# Altium schematic sheet bms-slave-magnetics.SchDoc: foxBMS BMS-Interface
size A3; DocumentNumber: 4; SheetNumber: 4; SheetTotal: 6; Author: Fraunhofer IISB foxBMS Team; REL-DATE: 2017-05-09; VERSION: 1.1.0; GateName_1: G$1; SymbolName_1: FRAME_B_L; LibraryName: foxBMS_BMS-Master_V1.00_A; DeviceSetName: FRAME_B_L; GateName_2: G$2; SymbolName_2: DOCFIELD; SheetDescription: Daisy Chain Isolation
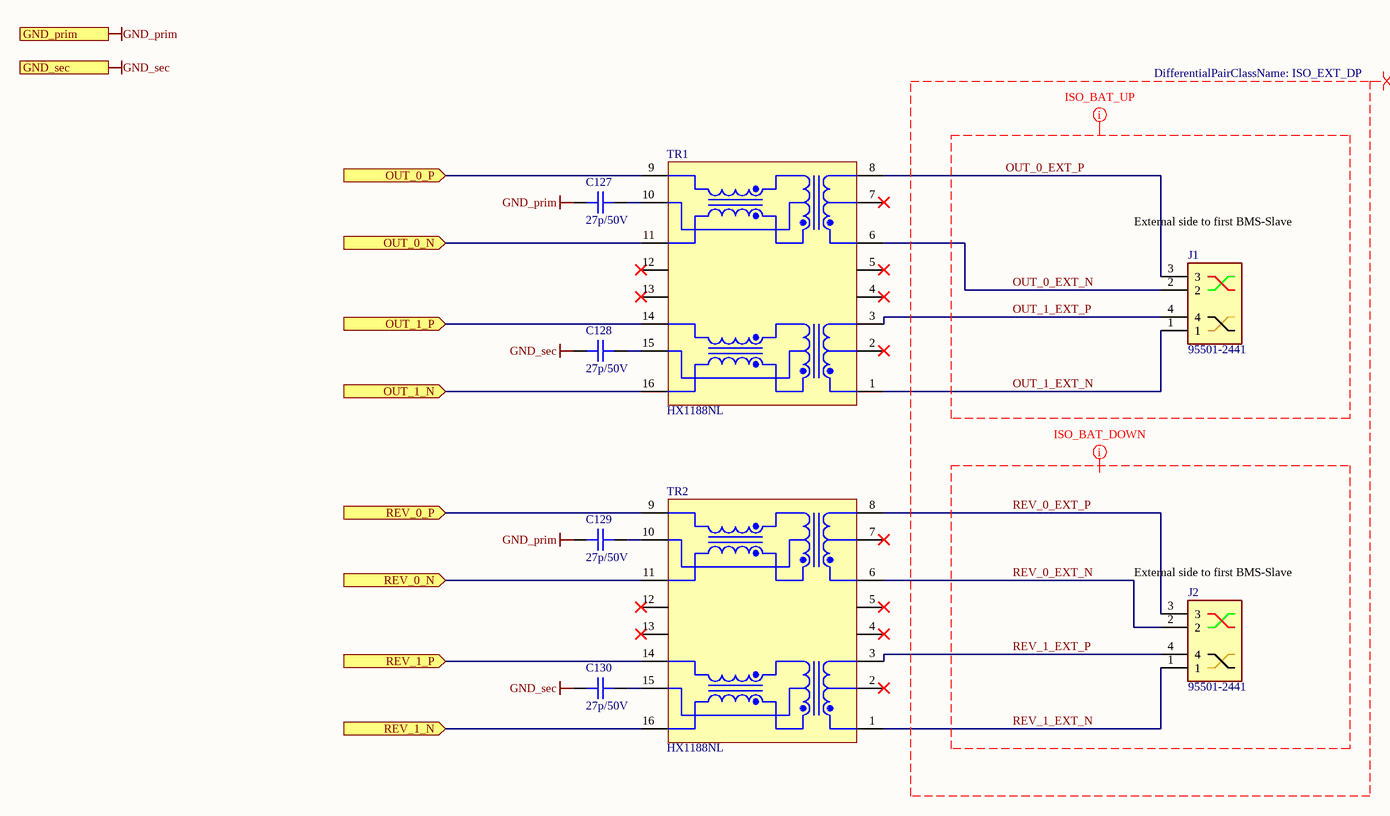
[diagram p0: bms-slave-magnetics.SchDoc]

## Parts
C127  27p/50V  [0603C]
C128  27p/50V  [0603C]
C129  27p/50V  [0603C]
C130  27p/50V  [0603C]
J1  95501-2441  [95501-2441]
J2  95501-2441  [95501-2441]
TR1  HX1188NL  [PULS-MODULE-16_V]
TR2  HX1188NL  [PULS-MODULE-16_V]

## Ports
GND_prim, GND_sec, OUT_0_N (in), OUT_0_P (in), OUT_1_N (in), OUT_1_P (in), REV_0_N (in), REV_0_P (in), REV_1_N (in), REV_1_P (in)

## Nets
GND_prim: C127.2 C129.2 ; port GND_prim
GND_sec: C128.1 C130.1 ; port GND_sec
OUT_0_EXT_N: J1.2 TR1.6
OUT_0_EXT_P: J1.3 TR1.8
OUT_0_N: TR1.11 ; port OUT_0_N
OUT_0_P: TR1.9 ; port OUT_0_P
OUT_1_EXT_N: J1.1 TR1.1
OUT_1_EXT_P: J1.4 TR1.3
OUT_1_N: TR1.16 ; port OUT_1_N
OUT_1_P: TR1.14 ; port OUT_1_P
REV_0_EXT_N: J2.2 TR2.6
REV_0_EXT_P: J2.3 TR2.8
REV_0_N: TR2.11 ; port REV_0_N
REV_0_P: TR2.9 ; port REV_0_P
REV_1_EXT_N: J2.1 TR2.1
REV_1_EXT_P: J2.4 TR2.3
REV_1_N: TR2.16 ; port REV_1_N
REV_1_P: TR2.14 ; port REV_1_P
NetC127_1: C127.1 TR1.10
NetC128_2: C128.2 TR1.15
NetC129_1: C129.1 TR2.10
NetC130_2: C130.2 TR2.15

Not connected (* = marked no-connect by the designer): TR1 2* 4* 5* 7* 12* 13*; TR2 2* 4* 5* 7* 12* 13*

## Layout directives
net class ISO_BAT; net class ISO_BAT_UP: OUT_0_EXT_N, OUT_0_EXT_P, OUT_1_EXT_N, OUT_1_EXT_P
net class ISO_BAT; net class ISO_BAT_DOWN: REV_0_EXT_N, REV_0_EXT_P, REV_1_EXT_N, REV_1_EXT_P
differential pair; differential pair class ISO_EXT_DP; rule Differential Pairs Routing [Pref Gap = 25.59mil    Min Gap  = 5mil    Max Gap  = 78.74milPref Width = 6mil    Min Width  = 0.955mil    Max Width  = 10.997mil]: OUT_0_EXT_N, OUT_0_EXT_P, OUT_1_EXT_N, OUT_1_EXT_P, REV_0_EXT_N, REV_0_EXT_P, REV_1_EXT_N, REV_1_EXT_P

## Notes on the sheet
- (near J1) External side to first BMS-Slave
- (near J2) External side to first BMS-Slave
- Fraunhofer IISB
- Schottkystr. 10
- developed by:
- 91058 Erlangen
- Germany
- Author
- Project
- License
- Description
- File
- Version
- Release Date
- Sheet
- www.foxbms.org
- www.iisb.fraunhofer.de
- foxBMS Team
- /

## Library data of the parts
C127-C130 = gen_C_ceramic_27p_50V_NP0_0603: MLCC; Capacitance: 27p; Rated Voltage: 50V; Dielectric: NP0; Case EIA: 0603; Case Metric: 1608; PnP Package: C_0603_05; Automotive Qualified: True; Part Number: gen_C_ceramic_27p_50V_NP0_0603; Supplier 1: Farnell; Supplier Part Number 1: 2219430; PnP Value: *
J1 J2 = 95501-2441: Connector; Manufacturer_Name: Molex; Allied_Number: 70372436; Datasheet Link: http://www.molex.com/webdocs/datasheets/pdf/en-us/0955012441_MODULAR_JACKS_PLUG.pdf; Manufacturer_Part_Number: 95501-2441; Mouser Part Number: 538-95501-2441; Mouser Price/Stock: https://www.mouser.com/Search/Refine.aspx?Keyword=538-95501-2441; RS Part Number: 2400913; RS Price/Stock: https://uk.rs-online.com/web/p/products/2400913; Allied Price/Stock: http://www.alliedelec.com/molex-incorporated-95501-2441/70372436/
TR1 TR2 = CMP-2000-05323-1: 10/100 Base-T Single Port Surface Mount Magnetic with Turns Ratio, -40 to 85 degC, 16-Pin Module, RoHS, Tube; Manufacturer: Pulse Electronics; Other Related Documents: PackagesFNLvs.NL; Other Names: 553-1340; PCN Design/Specification: ThermoplasticHeaderDesign28/Jun/2013; Transformer Type: IsolationandDataInterface(Encapsulated); PCN Other: HaloInjunctionRes1/Sep/2015; Turns Ratio - Primary: Secondary:1:1Transmitter,1:1Receiver; Family: PulseTransformers; Datasheet URL: https://datasheet.ciiva.com/26929/hx1188nl-26929858.pdf; Mounting Type: SurfaceMount; Size / Dimension: 12.70mmLx7.11mmW; Inductance: -; Package Description: 16-Pin Surface Mount Device, Body 12.7 x 7.11 mm, Pitch 1.27 mm; Height - Seated (Max): 6.22mm; E.T.: -; Online Catalog: 10/100BASE-TSinglePort; Manufacturer URL: http://www.pulseelectronics.com/; Package Reference: MODULE-16; Series: -; Category: Transformers; Standard Package: 40; Datasheet Version: Rev. H325.Q, 09/2009